# EAGLE design GBC USB-C Charging Kit Pro (EAGLE 6.2)
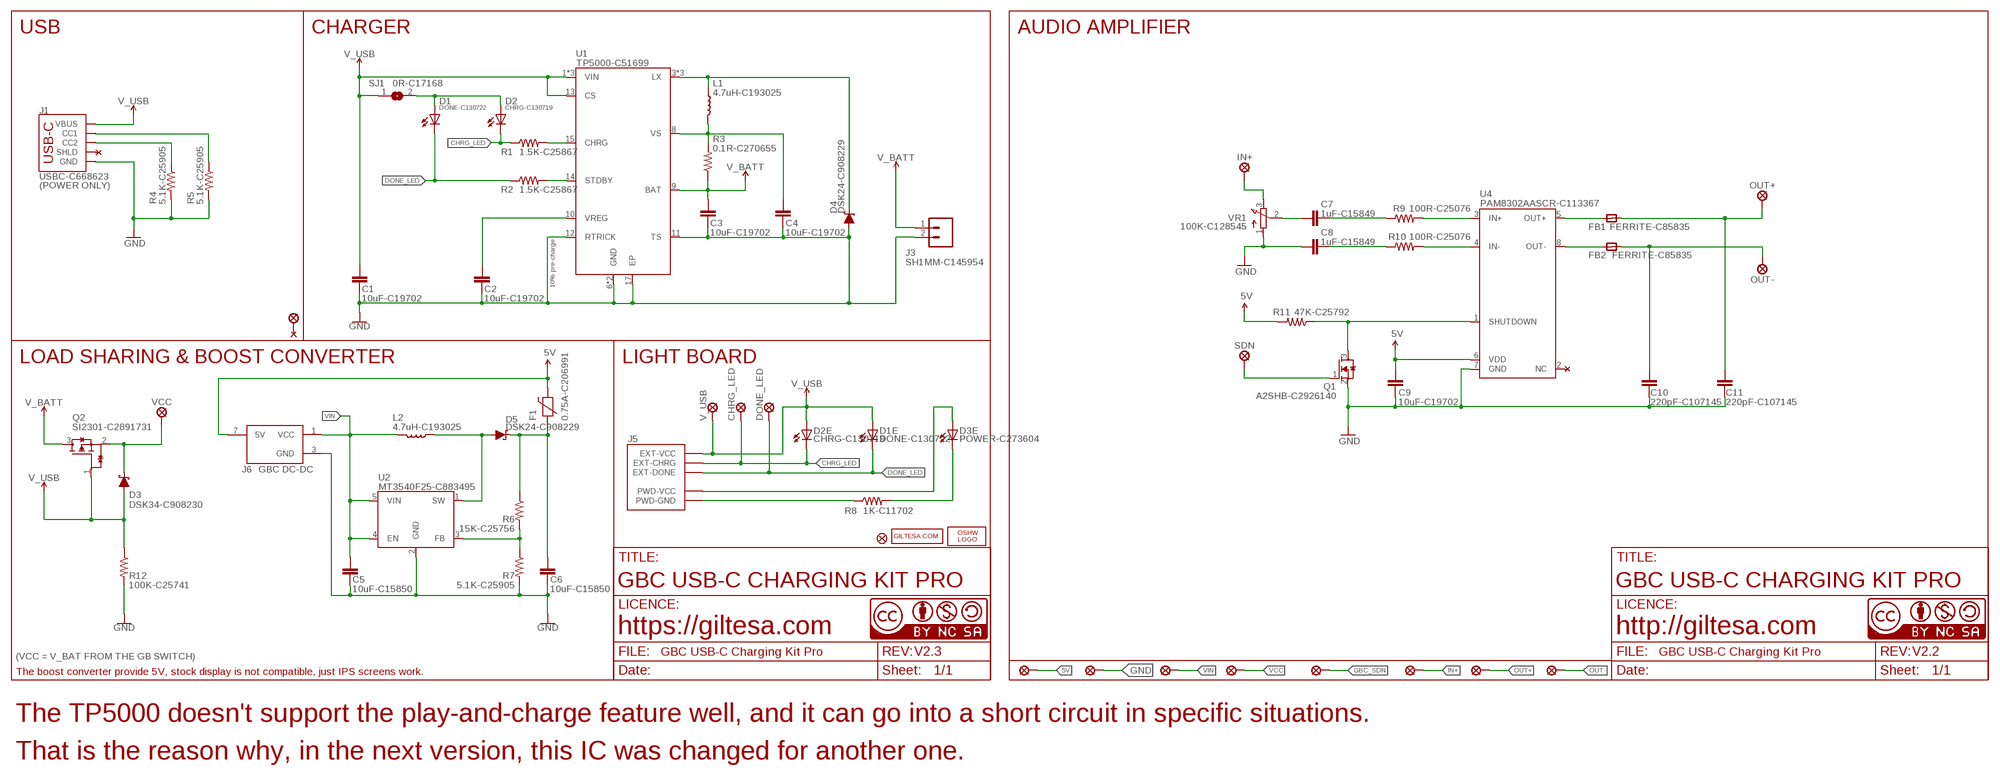
[diagram p0: schematic, sheet 1]

## Parts
C1  10uF-C19702  C0603_SMALL  [C0603_S]
C2  10uF-C19702  C0603_SMALL  [C0603_S]
C3  10uF-C19702  C0603_SMALL  [C0603_S]
C4  10uF-C19702  C0603_SMALL  [C0603_S]
C5  10uF-C15850  C0805_SMALL  [C0805_S]
C6  10uF-C15850  C0805_SMALL  [C0805_S]
C7  1uF-C15849  C0603_SMALL  [C0603_S]
C8  1uF-C15849  C0603_SMALL  [C0603_S]
C9  10uF-C19702  C0603_SMALL  [C0603_S]
C10  220pF-C107145  C0805_SMALL  [C0805_S]
C11  220pF-C107145  C0805_SMALL  [C0805_S]
D1  DONE-C130722  L0402  [L0402]
D1E  DONE-C130722  L0402  [L0402]
D2  CHRG-C130719  L0402  [L0402]
D2E  CHRG-C130719  L0402  [L0402]
D3  DSK34-C908230  DIODE-SCHOTTKY_SOD-123FL  [SOD-123FL]
D3E  POWER-C273604  L0402  [L0402]
D4  DSK24-C908229  DIODE-SCHOTTKY_SOD-123FL  [SOD-123FL]
D5  DSK24-C908229  DIODE-SCHOTTKY_SOD-123FL  [SOD-123FL]
F1  0.75A-C206991  FUSE0603_S  [F0603_S]
FB1  FERRITE-C85835  MICROBUILDER_FERRITE_SMALL  [MICROBUILDER__0805MP_S]
FB2  FERRITE-C85835  MICROBUILDER_FERRITE_SMALL  [MICROBUILDER__0805MP_S]
FD1  FIDUCIALUFIDUCIAL  [FIDUCIAL-MICRO]
FD2  FIDUCIALUFIDUCIAL  [FIDUCIAL-MICRO]
FD3  FIDUCIALUFIDUCIAL  [FIDUCIAL-MICRO]
J1  USBC-C668623  USB-CPOWER  [USB-C_6P]
J3  SH1MM-C145954  JST-21MM  [JST-2-1MM-SMD_RIGHT]
J5  GBC_LED  [GBC_LED]
J6  GBC DC-DC  GBC_DC_DCDIP  [GBC_DC_DC_DIP]
L1  4.7uH-C193025  INDUCTOR_2  [PSPMAA0402]
L2  4.7uH-C193025  INDUCTOR_2  [PSPMAA0402]
LOGO2  OSHW_LOGO_FILLX0150-NT  [OSHW_FILLX150_NOTEXT]
PP1  SOLDER_PAD-1.5  [SOLDER_PAD_1.5]
PP2  SOLDER_PAD-1.5  [SOLDER_PAD_1.5]
PP3  SOLDER_PAD-1.5  [SOLDER_PAD_1.5]
PP4  SOLDER_PAD-1.5  [SOLDER_PAD_1.5]
PP5  SOLDER_PAD-1.5  [SOLDER_PAD_1.5]
PP6  SOLDER_PAD-1.5  [SOLDER_PAD_1.5]
PP7  SOLDER_PAD-1.5  [SOLDER_PAD_1.5]
PP8  SOLDER_PAD-1.5  [SOLDER_PAD_1.5]
Q1  A2SHB-C2926140  MOSFET-NCHANNEL_SMALL  [SOT23-3_S]
Q2  SI2301-C2891731  DMP1045U_SMALL  [SOT23-3_S]
R1  1.5K-C25867  R0402  [R0402]
R2  1.5K-C25867  R0402  [R0402]
R3  0.1R-C270655  R0402  [R0402]
R4  5.1K-C25905  R0402  [R0402]
R5  5.1K-C25905  R0402  [R0402]
R6  15K-C25756  R0402  [R0402]
R7  5.1K-C25905  R0402  [R0402]
R8  1K-C11702  R0402  [R0402]
R9  100R-C25076  R0402  [R0402]
R10  100R-C25076  R0402  [R0402]
R11  47K-C25792  R0402  [R0402]
R12  100K-C25741  R0402  [R0402]
SJ1  0R-C17168  JUMPER-SMD0402  [JUMPER-SMD_0402]
U1  TP5000-C51699  TP5000  [QFN-16_4X4]
U2  MT3540F25-C883495  MT3540  [SOT-23-5]
U4  PAM8302AASCR-C113367  PAM8302A_ASCR  [PAM8302AASCR]
U$2  SDN  PAD_1.0  [PAD_1.0]
U$6  CC-BY-NC-SA15MM  [CC-BY-NC-SA_15MM]
U$16  GILTESA.COM_MASK  [GILTESA.COM_MASK]
U$17  CC-NC-BCNIX  [CC-NC-B_NIX]
U$20  OUT+  SOLDER_PAD-2.0  [SOLDER_PAD_2.0]
U$21  CC-NC-BCNIX  [CC-NC-B_NIX]
U$23  OUT-  SOLDER_PAD-2.0  [SOLDER_PAD_2.0]
U$24  CHRG_LED  SOLDER_PAD-1.3  [SOLDER_PAD_1.3]
U$25  DONE_LED  SOLDER_PAD-1.3  [SOLDER_PAD_1.3]
U$26  V_USB  SOLDER_PAD-1.3  [SOLDER_PAD_1.3]
U$29  VCC  PAD_1.25  [PAD_1.25]
U$30  IN+  SOLDER_PAD-1.3  [SOLDER_PAD_1.3]
U$32  SOLDER_PAD-2.5  [SOLDER_PAD_2.5]
VR1  100K-C128545  TRIMPOT3303W/X  [TRIMPOT_BOURNS_3303W]

## Nets
5V: C9.1 F1.2 J6.7(5V) PP1.P$1 R11.2 U4.6(VDD)
CHRG_LED: D2.C D2E.C J5.EXT-CHRG R1.1 U$24.P$1
DONE_LED: D1.C D1E.C J5.EXT-DONE R2.1 U$25.P$1
GBC_SDN: PP5.P$1 Q1.1(G) U$2.P$1
GND: C1.1 C2.1 C3.1 C4.1 C5.1 C6.1 C8.2 C9.2 C10.2 C11.2 D4.A J1.GND1(GND) J1.GND2(GND) J3.2 J6.3(GND) PP2.P$1 Q1.2(S) R4.2 R5.2 R7.2 R12.2 U1.6(GND) U1.7(GND) U1.11(TS) U1.12(RTRICK) U1.17(EP) U2.2(GND) U4.7(GND) VR1.1(A)
IN+: PP6.P$1 U$30.P$1 VR1.3(E)
N$1: D1.A D2.A SJ1.2
N$2: C6.2 D5.C F1.1 R6.1
N$3: D5.A L2.P$1 U2.1(SW)
N$4: J1.B5(CC2) R4.1
N$6: R1.2 U1.15(CHRG)
N$7: R6.2 R7.1 U2.3(FB)
N$8: J5.PWD-GND R8.1
N$9: R10.2 U4.4(IN-)
N$10: D3E.A J5.PWD-VCC
N$11: D3E.C R8.2
N$12: R9.2 U4.3(IN+)
N$13: J1.A5(CC1) R5.1
N$16: C8.1 R10.1
N$17: FB2.1 U4.8(OUT-)
N$18: C2.2 U1.10(VREG)
N$19: R2.2 U1.14(STDBY)
N$20: C4.2 L1.P$2 R3.2 U1.8(VS)
N$21: D4.C L1.P$1 U1.3(LX) U1.4(LX) U1.5(LX)
N$22: FB1.1 U4.5(OUT+)
N$23: C7.1 R9.1
N$25: C7.2 VR1.2(S)
OUT+: C11.1 FB1.2 PP7.P$1 U$20.P$1
OUT-: C10.1 FB2.2 PP8.P$1 U$23.P$1
SDN: Q1.3(D) R11.1 U4.1(SHUTDOWN)
V_BATT: C3.2 J3.1 Q2.3(D) R3.1 U1.9(BAT)
V_USB: C1.2 D1E.A D2E.A D3.A J1.VBUS1(VBUS) J1.VBUS2(VBUS) J5.EXT-VCC Q2.1(G) R12.1 SJ1.1 U1.1(VIN) U1.2(VIN) U1.13(CS) U1.16(VIN) U$26.P$1
VCC: D3.C PP4.P$1 Q2.2(S) U$29.P$1
VIN: C5.2 J6.1(VCC) L2.P$2 PP3.P$1 U2.4(EN) U2.5(VIN)
Unconnected: J1.SHLD1(SHLD) J1.SHLD2(SHLD) J1.SHLD3(SHLD) J1.SHLD4(SHLD) J1.SHLD5(SHLD) J1.SHLD6(SHLD) J1.SHLD7(SHLD) J1.SHLD8(SHLD) U4.2(NC) U$32.P$1

## Notes on the sheet
- USB | CHARGER | AUDIO AMPLIFIER
- (POWER ONLY)
- 10% pre-charge
- LOAD SHARING & BOOST CONVERTER | LIGHT BOARD
- GBC USB-C CHARGING KIT PRO | GBC USB-C CHARGING KIT PRO
- https://giltesa.com | http://giltesa.com
- (VCC = V_BAT FROM THE GB SWITCH) | V2.3 | V2.2
- The boost converter provide 5V, stock display is not compatible, just IPS screens work.
- The TP5000 doesn't support the play-and-charge feature well, and it can go into a short circuit in specific situations.
- That is the reason why, in the next version, this IC was changed for another one.

## Library data of the parts
C1-C4 C7-C9 = ,giltesa:C0603
C5 C6 C10 C11 = ,giltesa:C0805
D1 D1E D2 D2E D3E = ,giltesa:L0402
D3-D5 = ,giltesa:DIODE-SCHOTTKY
F1 = ,giltesa:FUSE
FB1 FB2 = microbuilder:MICROBUILDER_FERRITE: Ferrite Bead 0603 MMZ1608B121C - 120 Ohm @ 100MHz, 600mA, 0.15 Ohm DC Resistance - Digikey: 445-2164-1-ND BK1608HW121-T - 120 Ohm, 600mA Ferrite Chip - Digikey: 587-1876-2-ND 0805 HZ0805B272R-10 - 2.7K Ohm @ 100MHz, 200mA, 0.8 Ohm DC Resistance - Digikey: 240-2504-1-ND (see also Murata BLM21BD272SN1L) MMZ2012Y152B - 1.5K Ohm @ 100MHz, 500mA, 0.4 Ohm DC Resistance - Digikey: 445-1560-1-ND - Mainly for high frequency (80-400MHz) MMZ2012R102A - 1K Ohm @ 100MHz, 500mA, 0.3 Ohm DC Resistance - Digikey: 445-1555-2-ND - More general purpose (10-200MHz)
FD1-FD3 = SparkFun-Aesthetics:FIDUCIAL: Fiducial Alignment Points Point-of-reference for pick-and-place machines and other optical instruments.
J1 = ,giltesa:USB-C
J3 = ,giltesa:JST-2
J5 = ,giltesa:GBC_LED
J6 = ,giltesa:GBC_DC_DC
L1 L2 = ,giltesa:INDUCTOR
LOGO2 = ohw-logo:OSHW_LOGO_FILL
PP1-PP8 U$20 U$23-U$26 U$30 U$32 = ,giltesa:SOLDER_PAD
Q1 = ,giltesa:MOSFET-NCHANNEL
Q2 = ,giltesa:DMP1045U
R1-R12 = ,giltesa:R0402
SJ1 = ,giltesa:JUMPER-SMD
U1 = ,giltesa:TP5000
U2 = ,giltesa:MT3540
U4 = ,giltesa:PAM8302A
U$2 U$29 = ,giltesa:PAD
U$6 = ,giltesa_logos:CC-BY-NC-SA
U$16 = ,giltesa_logos:GILTESA.COM
U$17 U$21 = cc-by-nc-sa:CC-NC-BC: All hardware is licensed under the Creative Commons Attribution-Noncommercial-Share Alike 2.5 Switzerland License. To view a copy of this license, visit http://creativecommons.org/licenses/by-nc-sa/2.5/ch/ or send a letter to Creative Commons, 171 Second Street, Suite 300, San Francisco, California, 94105, USA.
VR1 = microbuilder:TRIMPOT: 3-Pin SMT Trimpots Bourns TC33 (X-2) Series 1K - Digikey: TC33X-102ECT-ND 10K - Digikey: TC33X-2-103E 100K - Digikey: TC33X-104ECT-ND Bourns 3303 (W) Series 3mm 10K Single Turn - Digikey: 3303W-103ETR-ND 3mm 100K Single Turn - Digikey: 3303X-104ETR-ND

## Net classes
1 power: width 0.61 mm, drill 0.406 mm, clearance 0.203 mm
2 gnd: width 0.305 mm, drill 0.406 mm, clearance 0.203 mm
3 power usb: width 0.508 mm, drill 0.406 mm, clearance 0.203 mm

## Board
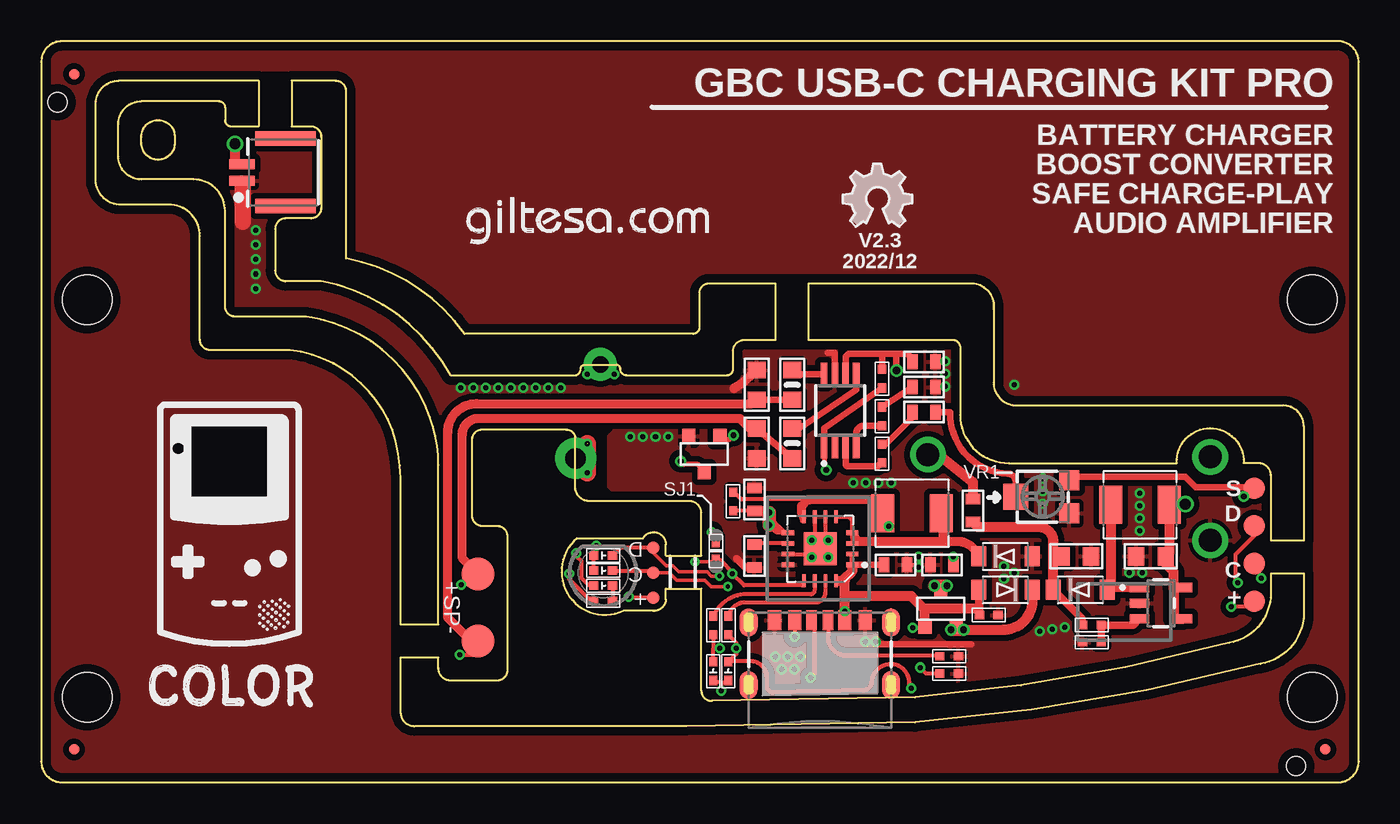
[diagram p1: board, top side]
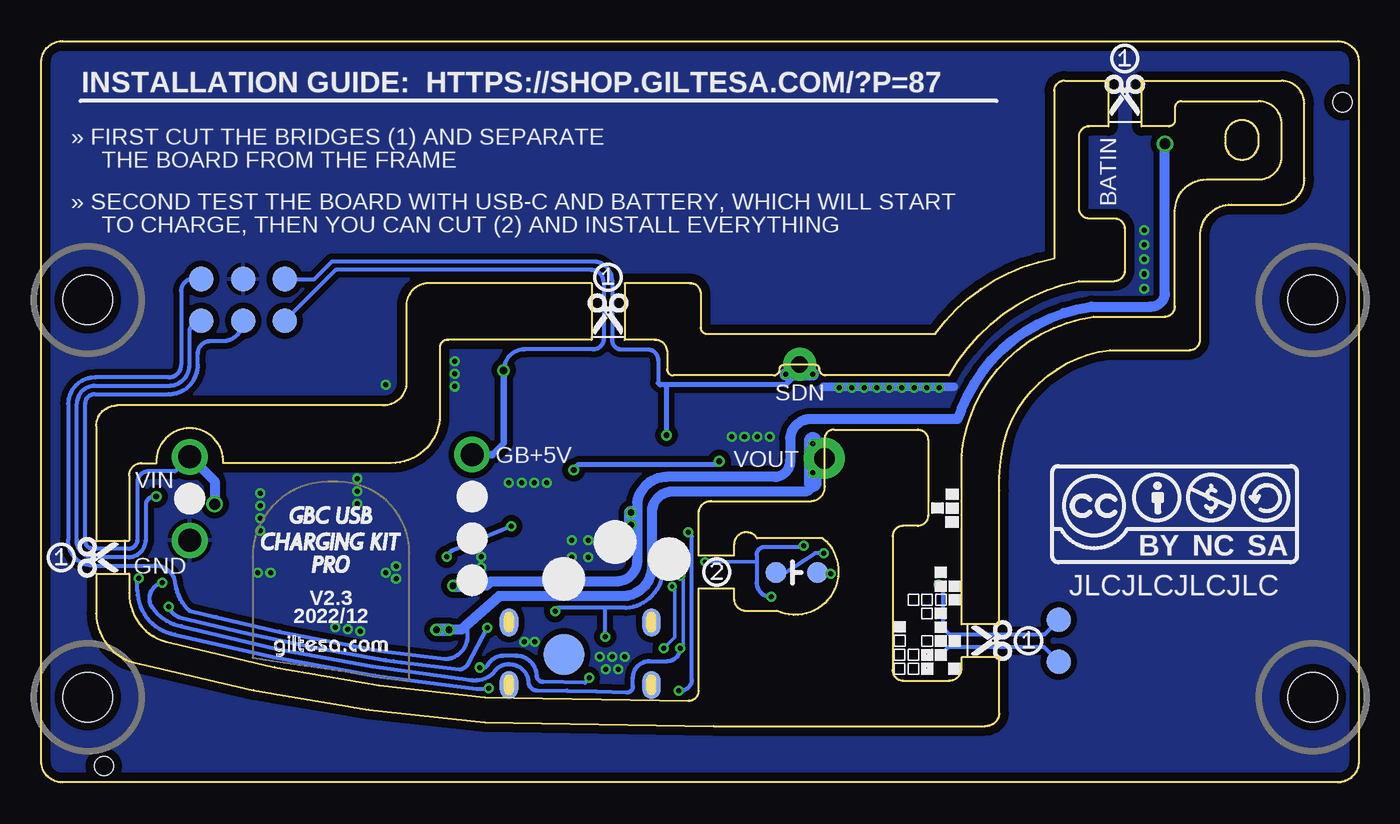
[diagram p2: board, bottom side, seen from below]

Size 80 x 45 mm. Coordinates in mm from the lower left corner, seen from the top.
Outline: 40.08,5.58 40.08,11.77 37.93,11.77 37.93,11.09 arc-90 37.13,10.42 35.33,10.42 arc-165 32.53,14.82 36.53,14.82 arc-149 37.93,14.44 37.93,13.77 40.08,13.77 40.08,16.38 arc90 39.31,17.07 33.23,17.07 arc-90 32.42,18 32.42,20.91 arc90 31.86,21.42 26.78,21.42 arc90 26.15,20.78 26.15,16.21 arc90 26.78,15.57 27.67,15.57 arc-90 28.31,14.94 28.31,6.81 arc-90 27.67,6.18 24.88,6.18 arc-90 24.11,6.94 24.11,7.59 21.83,7.59 21.83,4.2 arc90 22.69,3.42 39.19,3.42 53.06,3.63 arc10 74.03,7.19 arc80 76.66,10.24 76.66,12.67 74.66,12.67 74.66,11.51 arc-80 72.12,8.46 arc-10 53.06,5.16 40.72,4.94 arc-90 40.08,5.58
Outline: 24.88,24.7 32.37,24.7 arc90 32.75,25.1 arc-90 33.01,25.35 34.91,25.35 arc-90 35.16,25.1 arc90 35.55,24.7 41.62,24.7 arc90 42,25.08 42,26.19 arc-90 42.76,26.86 44.58,26.86 44.58,30.29 40.6,30.29 arc90 39.97,29.75 39.97,27.62 arc-90 39.58,27.23 25.71,27.23 arc44 18.5,31.81 18.5,41.98 arc90 17.87,42.6 15.21,42.6 15.21,39.83 16.37,39.83 arc-90 17,39.2 17,34.88 arc-90 16.37,34.24 14.84,34.24 arc90 14.21,33.61 14.21,31.07 arc90 14.84,30.43 17,30.43 arc-50 24.88,24.7
Outline: 46.58,26.86 55.28,26.86 arc-90 55.79,26.48 55.79,22.3 arc90 58.76,19.38 68.95,19.38 arc-185 73.01,19.38 73.9,19.38 arc-90 74.66,18.62 74.66,14.67 76.66,14.67 76.66,21.62 arc90 75.4,22.88 59.24,22.88 arc-90 57.82,24.28 57.82,28.73 arc90 56.65,30.29 46.58,30.29 46.58,26.86
Outline: 1.27,0 78.7,0 arc90 80,1.27 80,43.73 arc90 78.7,45 1.27,45 arc90 0,43.73 0,1.27 arc90 1.27,0
Outline: 23.61,22.18 arc62 16.11,28.27 11.8,28.27 arc-90 11.16,28.91 11.16,34.7 arc90 9.26,36.6 6.08,36.6 arc-90 4.68,38 4.68,39.96 arc-90 6.08,41.35 10.78,41.35 arc-90 11.16,40.97 11.16,40.21 arc90 11.54,39.83 13.21,39.83 13.21,42.6 4.71,42.6 arc90 3.31,41.2 3.31,36.68 arc90 4.71,35.08 7.73,35.08 arc-90 9.64,33.18 9.64,26.88 arc90 10.27,26.24 15.1,26.24 arc-62 21.32,21.42 arc-20 21.83,17.73 21.83,9.59 24.11,9.59 24.11,19.26 arc20 23.61,22.18
Outline: 6.08,39.2 arc-180 8.11,39.2 8.11,38.81 arc-180 6.08,38.81 6.08,39.2
Copper layers (1*16): Top 0.035mm / dielectric 1.6mm / Bottom 0.035mm
Design rules: minimum track width 6mil, minimum drill 12mil, track to track 6mil, track to pad 6mil, pad to pad 6mil, via to via 8mil, smd to smd 0mil, copper to edge 20mil, drill to drill 10mil, minimum pad ring 6mil, minimum via ring 6mil, stop-mask expansion 0mil, vias tented up to drill 100mil, thermal gap 10mil
Holes 3 mm at 77.17,29.29 2.8,29.29 2.8,5.16 77.17,5.16
tRestrict: area 9.4,17.6 to 13.4,21.4; area 8.4,20.3 to 8.4,20.3; 10 lines
bRestrict: 6 lines

### Footprints (pad centres in the part's own frame; a part is rotated, then mirrored left to right if it is on the bottom)
C0603_S = smd 0.635 x 0.9: 1 -0.694,0; 2 0.694,0
C0805_S = smd 1 x 1.1: 1 -0.901,0; 2 0.901,0
L0402 = smd 0.559 x 0.5: A -0.567,0; C 0.567,0
SOD-123FL = smd 0.91 x 1.22: A -1.637,0; C 1.637,0
F0603_S = smd 0.635 x 0.9: 1 -0.694,0; 2 0.694,0
MICROBUILDER__0805MP_S = smd 1 x 1.1: 1 -0.901,0; 2 0.901,0
FIDUCIAL-MICRO = smd 0.635 x 0.635: 1 0,0
USB-C_6P = smd 0.635 x 1.2: A5 -0.5,-0.017; B5 0.5,-0.017 | smd 0.8 x 1.2: GND1 -2.75,-0.017; GND2 2.75,-0.017; VBUS1 -1.52,-0.017; VBUS2 1.52,-0.017 | smd 1.1 x 1.7: SHLD1 -4.32,-0.15; SHLD2 4.32,-0.15; SHLD5 -4.32,-3.95; SHLD8 4.32,-3.95 | smd 1.1 x 1.7 bottom: SHLD3 -4.32,-0.15; SHLD4 4.32,-0.15; SHLD6 -4.32,-3.95; SHLD7 4.32,-3.95
JST-2-1MM-SMD_RIGHT = smd 0.6 x 1.524: 1 -0.5,-2.017; 2 0.5,-2.017 | smd 0.889 x 3.683: NC1 -2.054,0.635; NC2 2.054,0.635
GBC_LED = smd 0.762 x 0.762: EXT-CHRG -3.048,0; EXT-DONE -3.048,-1.524; EXT-VCC -3.048,1.524 | smd 1.27 x 1.27 bottom: PWD-GND 1.27,0; PWD-VCC -1.27,0
GBC_DC_DC_DIP = drill 1.397 pad 2.159: 1 17.145,7.493; 3 17.145,2.413; 7 0,7.62
PSPMAA0402 = smd 1.4 x 2.3: P$1 -1.775,0; P$2 1.775,0
SOLDER_PAD_1.5 = smd 1.5 x 1.5: P$1 0,0
SOT23-3_S = smd 0.8 x 0.9: 1 -0.95,-1.076; 2 0.95,-1.076; 3 0,1.1
R0402 = smd 0.559 x 0.5: 1 -0.567,0; 2 0.567,0
JUMPER-SMD_0402 = smd 0.635 x 0.5: 1 -0.559,0; 2 0.559,0
QFN-16_4X4 = smd 0.81 x 0.3: 1 -1.95,0.975; 2 -1.95,0.325; 3 -1.95,-0.325; 4 -1.95,-0.975; 9 1.95,-0.975; 10 1.95,-0.325; 11 1.95,0.325; 12 1.95,0.975 | smd 0.3 x 0.81: 5 -0.975,-1.95; 6 -0.325,-1.95; 7 0.325,-1.95; 8 0.975,-1.95; 13 0.975,1.95; 14 0.325,1.95; 15 -0.325,1.95; 16 -0.975,1.95 | smd 2 x 2: 17 0,0
SOT-23-5 = smd 0.55 x 1.2: 1 -0.95,-1.3; 2 0,-1.3; 3 0.95,-1.3; 4 0.95,1.3; 5 -0.95,1.3
PAM8302AASCR = smd 0.4 x 1.4: 1 -0.975,-2.2; 2 -0.325,-2.2; 3 0.325,-2.2; 4 0.975,-2.2; 5 0.975,2.2; 6 0.325,2.2; 7 -0.325,2.2; 8 -0.975,2.2
PAD_1.0 = drill 1 pad 2: P$1 0,0
JLCPCB_TOOLING_HOLES = hole 1.153: 0,0
SOLDER_PAD_2.0 = smd 2 x 2: P$1 0,0
SOLDER_PAD_1.3 = smd 1.3 x 1.3: P$1 0,0
PAD_1.25 = drill 1.25 pad 2.5: P$1 0,0
SOLDER_PAD_2.5 = smd 2.5 x 2.5: P$1 0,0
TRIMPOT_BOURNS_3303W = smd 1.2 x 1.2: 1 -1,-1.6; 3 1,-1.6 | smd 1.6 x 1.5: 2 0,1.65

### Placement (x,y rotation side)
C1  51.86,13.21 180 top
C2  43.31,13.74 90 top
C3  43.31,17.18 270 top
C4  54.69,13.21 0 top
C5  67.38,13.72 0 top
C6  62.84,13.72 180 top
C7  53.59,22.48 0 top
C8  53.59,24 0 top
C9  53.59,25.53 0 top
C10  43.43,24.13 90 top
C11  43.43,20.57 270 top
D1  40.81,6.75 90 top
D1E  34.12,13.77 0 top
D2  41.72,6.75 90 top
D2E  34.12,12.86 0 top
D3  58.55,11.68 0 top
D3E  34.12,11.95 0 top
D4  58.55,13.72 180 top
D5  63.1,11.68 180 top
F1  56.58,16.51 90 top
FB1  45.59,20.57 270 top
FB2  45.59,24.13 270 top
FD1  2,43 0 top
FD2  2,2 0 top
FD3  77.97,2 0 top
J1  47.28,9.87 0 top
J3  14.21,37.04 270 top
J5  34.12,12.73 180 top
J6  53.83,12.27 0 top
L1  52.88,16.34 180 top
L2  66.71,16.85 0 top
LOGO2  48.65,33.75 0 top
PP1  65.2,28.02 0 bottom
PP2  67.75,30.56 0 bottom
PP3  67.75,28.02 0 bottom
PP4  70.28,30.56 0 bottom
PP5  65.2,30.56 0 bottom
PP6  70.28,28.02 0 bottom
PP7  18.21,9.86 0 bottom
PP8  18.21,7.32 0 bottom
Q1  40.26,19.94 180 top
Q2  54.61,10.54 0 top
R1  41.72,9.53 90 top
R2  40.81,9.53 90 top
R3  42.01,17.05 90 top
R4  55.13,7.65 0 top
R5  55.13,6.61 0 top
R6  63.79,9.55 0 top
R7  63.79,8.51 180 top
R8  34.12,11.03 0 top
R9  51.05,19.96 270 top
R10  51.05,22.23 270 top
R11  51.05,24.51 90 top
R12  57.53,10.16 0 top
SJ1  40.96,14.05 90 top
U1  47.29,14.18 180 top
U2  67.98,10.88 270 top
U4  48.51,22.59 0 top
U$2  33.94,25.38 0 top
U$6  18.74,13.24 0 bottom
U$7  [GAME_BOY_COLOR_1.2]  6.52,4.55 0 top
U$8  [SCISSOR]  45.57,27.19 90 bottom
U$10  [TETRIS]  24.05,6.43 0 top
U$12  [JLCPCB_TOOLING_HOLES]  1,41.29 0 top
U$13  [SCISSOR]  14.2,40.46 90 bottom
U$14  [SCISSOR]  23.55,8.6 0 bottom
U$15  [SCISSOR]  75.29,13.67 180 bottom
U$16  25.7,32.59 0 top
U$17  0,0 0 top
U$18  [JLCPCB_TOOLING_HOLES]  76.19,1 0 top
U$20  26.53,12.65 0 top
U$21  0,0 0 top
U$23  26.53,8.59 0 top
U$24  73.64,13.29 0 top
U$25  73.64,15.57 0 top
U$26  73.64,11 0 top
U$28  [GAME_BOY_COLOR_2]  7.02,8.21 0 top
U$29  32.45,19.67 0 top
U$30  73.64,17.86 0 top
U$32  48.27,7.78 0 bottom
U$33  [GILTESA.COM_MASK_7MM]  65.9,7.57 0 bottom
U$34  [GAME_BOY_COLOR_USB_CHARGING_KIT_PRO]  66.66,12.65 0 bottom
U$36  [SCISSOR_ONE]  20.05,8.6 0 bottom
U$37  [SCISSOR_ONE]  78.78,13.65 0 bottom
U$38  [SCISSOR_ONE]  45.58,30.67 0 bottom
U$39  [SCISSOR_ONE]  14.21,43.95 0 bottom
U$40  [SCISSOR_TWO]  38.99,12.78 0 bottom
VR1  60.82,17.34 90 top

### Tracks (layer width: path | path; a pad name or v marks a point on that pad's centre or on a via)
5V  (via drill 0.46)
  Top 0.406: U4.6 48.84,25.73 arc-90 49.15,26.04 51.18,26.04 | 51.18,26.04 51.92,26.04 | 51.92,26.04 52.39,26.04 arc-90 C9.1 | 51.18,26.04 51.05,25.91 R11.2 | v51.92,25.02 51.92,26.04
  Top 0.61: J6.7 54.48,19.89 56.58,18.22 F1.2
  Bottom 0.254: 65.01,28.08 65.01,28.02 PP1.P$1 62.11,31.11 46.61,31.11 arc90 45.85,30.35 45.85,26.92 arc90 46.48,26.29 50.65,26.29 arc-90 v51.92,25.02
  Bottom 0.406: 52.6,19.89 51.92,20.57 v51.92,25.02
  Bottom 0.457: 52.6,19.89 J6.7
CHRG_LED  (via drill 0.25, 0.3)
  Top 0.203: 37.24,12.73 J5.EXT-CHRG 38.13,12.73 38.59,12.28 40.3,12.28 40.69,11.89 v41.69,11.89
  Top 0.254: D2E.C 37.04,12.86 J5.EXT-CHRG | U$24.P$1 v74.09,12.4 | v52.83,5.71 52.7,5.71 52.7,6.1 arc90 51.56,7.18 arc85 50.42,6.1 arc-90 49.91,5.59 44.45,5.46 arc-93 44.07,5.84 44.07,6.35 arc90 43.05,7.37 41.77,7.37 arc90 D2.C 42.21,7.81 v42.21,8.13 42.21,8.47 R1.1
  Bottom 0.203: v42.21,8.13 41.53,8.81 41.53,11.73 v41.69,11.89
  Bottom 0.254: v74.09,12.4 74.15,12.34 74.15,11.64 arc-80 71.87,8.97 arc-8 53.58,5.67 52.88,5.67 v52.83,5.71
DONE_LED  (via drill 0.25, 0.3)
  Top 0.203: J5.EXT-DONE 37.17,13.95 37.96,13.16 38.34,13.16 38.72,12.78 40.44,12.78 40.69,12.53 v41.18,12.53
  Top 0.254: J5.EXT-DONE 35.18,14.26 D1E.C | U$25.P$1 73.64,15.45 | U$25.P$1 73.64,15.7 | R2.1 40.81,8.13 | 40.81,8.13 v41.21,8.13 | D1.C 40.81,8.13 | v72.64,12.13 72.52,12.32 72.52,13.84 73.66,14.99 73.66,15.56 U$25.P$1
  Bottom 0.203: v41.21,8.13 41.14,8.13 41.02,8.26 41.02,12.36 v41.18,12.53
  Bottom 0.254: v41.21,8.13 arc90 41.98,7.37 43.05,7.37 arc-90 44.07,6.35 44.07,5.84 arc95 44.45,5.46 arc-3 49.91,5.59 arc90 50.42,6.1 arc-85 51.56,7.18 51.69,7.18 arc-58 52.53,6.64 arc53 54.01,6.23 arc8 71.49,9.48 arc45 73.26,10.62 arc109 v72.64,12.13
GBC_SDN  (via drill 0.3, 0.36)
  Top 0.305: Q1.1 41.23,20.83 41.78,20.83 v42.04,21.08
  Bottom 0.254: PP5.P$1 63.42,30.56 62.36,31.62 46.48,31.62 arc90 45.34,30.48 45.34,26.92 arc-90 44.83,26.29 43.18,26.29 arc90 42.55,25.65 42.55,24.26 | v34.8,24.77 34.16,24.77 34.1,24.83
  Bottom 0.305: U$2.P$1 33.95,24.98 34.1,24.83 34.8,24.13 42.04,24.13 | 42.04,24.13 42.42,24.13 42.55,24.26 | 42.04,24.13 v42.04,21.08
  Bottom 0.762: v33.15,24.77 v34.8,24.77
GND  (via drill 0.3)
  Top 0.254: U1.11 46.84,13.86 | U1.6 47.62,14.73 | 47.62,14.73 47.49,14.61 | v47.8,14.69 47.53,14.69 47.62,14.73 | U1.7 46.97,14.51 U1.17 | C1.1 53.27,13.21 v53.27,13.68
  Top 0.406: 46.84,13.86 47.49,13.86 47.49,14.51 | 47.49,14.51 47.49,14.61 | 47.49,14.51 47.16,14.51 | 46.97,14.51 47.16,14.51 | 47.16,14.51 U1.17 | U4.7 48.19,26.08 48.01,26.08 47.75,26.08 | 56.46,8.39 50.8,8.39 v50.66,8.54
  Top 0.457: C2.1 42.77,13.04 42.23,13.59
  Top 0.559: 43.32,25.03 arc-30 42.06,23.93
  Top 0.711: C10.2 43.32,25.03
  Top 1.016: 12.25,34.04 12.25,36.22
  Bottom 0.508: 24.59,24.03 32.51,24.03
  other vias: 25.46,23.96 26.22,23.96 26.99,23.96 27.75,23.96 28.51,23.96 29.27,23.96 30.03,23.96 30.8,23.96 31.56,23.96 13.02,33.53 13.02,32.64 13.02,31.75 13.02,30.86 13.02,29.98 44.57,7.62 45.34,7.62 46.1,7.62 44.96,6.86 45.72,6.86 46.78,14.69 46.78,13.67 54.9,25.56 54.9,24.8 54.9,24.04 59.09,24.15 49.31,18.19 50.07,18.19 50.84,18.19 51.6,18.19 35.77,20.99 36.54,20.99 47.8,13.67 50.02,8.54 53.27,13.05 60.62,9.18 61.38,9.3 62.14,9.43 66.71,17.56 66.71,16.8 66.71,16.03 66.71,15.27 60.82,18.45 60.82,17.68 60.82,16.92 66.08,12.73 66.84,12.73 58.46,13.11 58.46,12.35 59.09,12.73 37.3,20.99 38.06,20.99
  pour Top (isolate 0.356): -2,47 81.97,47 81.97,-2 -2,-2
  pour Bottom (isolate 0.356): -2,47 81.97,47 81.97,-2 -2,-2
IN+  (via drill 0.36)
  Top 0.254: v73.01,17.35 73.52,17.86 U$30.P$1
  Top 0.406: U$30.P$1 73.6,17.91 70.1,17.91 69.47,18.54 62.62,18.54 arc90 VR1.3
  Bottom 0.254: v73.01,17.35 73.14,17.35 arc-90 73.64,16.84 73.64,14.74 arc90 74.71,13.67 76.85,13.67 arc94 77.84,14.74 77.84,22.99 arc90 76.75,24.07 72.26,24.07 arc-90 70.99,25.34 70.99,27.31 arc90 PP6.P$1
  Bottom 0.406: 72.96,17.4 v73.01,17.35
N$1  (via drill 0.3)
  Top 0.254: 41.28,6.07 v41.28,5.55 | SJ1.2 v40.71,15.19 | 41.28,6.07 40.92,6.07 arc-90 D1.A | 41.28,6.07 41.61,6.07 arc90 D2.A
  Bottom 0.254: v40.71,15.19 40.5,14.91 40.5,6.2 arc90 v41.28,5.55
N$2
  Top 0.457: R6.1 63.22,9.92 D5.C
  Top 0.61: D5.C 61.46,13.72 | 61.46,13.72 61.46,14.61 arc90 60.58,15.49 56.84,15.49 F1.1 | C6.2 61.46,13.72
N$3
  Top 0.61: L2.P$1 64.94,11.88 D5.A 64.88,11.83 U2.1
N$4
  Top 0.254: J1.B5 47.78,8.87 arc90 48.9,7.68 54.52,7.68 R4.1
N$6
  Top 0.254: U1.15 47.62,11.55 arc-90 46.99,10.92 42.68,10.92 arc75 R1.2
N$7
  Top 0.457: R7.1 R6.2 66.3,9.55 U2.3
N$8  (via drill 0.3)
  Top 0.254: R8.1 33.31,11.08 32.05,12.34 v32.05,12.65
  Bottom 0.254: J5.PWD-GND 32.07,12.73 v32.05,12.65
N$9
  Top 0.406: R10.2 49.98,21.66 arc90 49.49,21.17 U4.4
N$10  (via drill 0.3)
  Top 0.254: D3E.A 33.24,11.97 32.81,12.4 32.81,13.41 32.5,13.73 v32.5,13.92
  Bottom 0.254: v32.5,13.92 33.01,13.92 34.83,12.73 J5.PWD-VCC
N$11
  Top 0.254: D3E.C R8.2
N$12
  Top 0.406: R9.2 51.02,19.4 50.8,19.18 49.02,19.18 arc-90 48.84,19.36 U4.3
N$13  (via drill 0.3)
  Top 0.254: 46.86,9.53 46.78,9.61 J1.A5 46.97,9.63 46.97,6.58 v46.74,6.35 | R5.1 53.73,6.61 v53.37,6.97
  Bottom 0.254: v46.74,6.35 46.99,6.04 49.53,6.1 arc90 49.91,6.48 arc-90 51.18,7.68 51.97,7.68 arc-59 52.88,7.14 53.05,6.97 v53.37,6.97
N$16
  Top 0.406: R10.1 C8.1
N$17
  Top 0.406: U4.8 45.84,24.79 FB2.1
N$18
  Top 0.254: C2.2 43.35,14.43 43.53,14.51 U1.10
N$19
  Top 0.254: U1.14 46.97,11.66 arc-90 46.74,11.43 42.65,11.43 arc60 R2.2
N$20  (via drill 0.3)
  Top 0.254: R3.2 42.07,17.62 42.51,17.18 46.58,17.18 arc-90 46.61,17.14 | 46.3,15.98 U1.8 46.2,15.86 46.02,16.36 46.18,16.38 | v51.45,15.54 51.17,16.34 L1.P$2 | C4.2 55.26,13.56 v55.39,13.69
  Top 0.559: 50.8,17.14 46.61,17.14 46.48,17.14 46.18,16.76 46.18,16.38
  Top 0.61: L1.P$2 51.1,16.84 50.8,17.14
  Bottom 0.254: v51.45,15.54 54.99,14.1 arc-44 v55.39,13.69
N$21
  Top 0.254: U1.4 49.24,15.78 arc90 48.89,16.13 U1.5 | U1.4 U1.3 | 49.4,14.86 49.24,14.86 U1.4
  Top 0.559: 54.74,14.64 49.59,14.64 49.4,14.86 | L1.P$1 54.48,16.17 54.48,15.62 54.74,15.62 54.74,14.64 | 54.74,14.64 55.61,14.64 arc-70 D4.C
N$22
  Top 0.406: U4.5 49.49,23.84 46.35,21.72 45.99,21.48 FB1.1
N$23
  Top 0.406: R9.1 51.27,20.53 52.91,22.18 C7.1
N$25
  Top 0.406: C7.2 55.19,22.48 arc90 58.67,18.75 arc-90 59.17,18.25 VR1.2
OUT+  (via drill 0.3)
  Top 0.254: v25.51,11.99 26.18,12.65 U$20.P$1
  Top 0.406: FB1.2 C11.1
  Top 0.559: U$20.P$1 25.58,13.61 25.58,21.13 arc-90 26.54,22.1 42.42,22.1 43.05,21.46 C11.1
  Top 0.61: U$20.P$1 26.34,12.65
  Bottom 0.254: PP7.P$1 19.11,8.97 24.84,8.97 25.27,9.4 25.27,11.75 v25.51,11.99
OUT-  (via drill 0.3)
  Top 0.254: v25.4,7.75 26.54,7.75 26.54,8.58 U$23.P$1
  Top 0.406: FB2.2 C10.1
  Top 0.559: 26.08,8.59 24.69,9.98 24.69,21.26 arc-90 26.42,22.99 43.18,22.99 C10.1
  Top 0.61: U$23.P$1 26.08,8.59
  Bottom 0.254: PP8.P$1 19.1,8.21 24.94,8.21 v25.4,7.75
SDN  (via drill 0.36)
  Top 0.305: Q1.3 40.26,18.92 39.88,19.3 39.02,19.3 v38.83,19.5 | U4.1 47.54,19.09 v47.67,18.96
  Top 0.406: U4.1 47.54,21.5 50.04,23.24 R11.1 | Q1.3 40.26,18.8
  Bottom 0.305: v47.67,18.96 47.67,19.01 47.37,19.3 39.02,19.3 v38.83,19.5
V_BATT  (via drill 0.41, 0.66)
  Top 0.254: U1.9 44.66,15.16 44.58,15.24 44.7,15.37 | 44.7,15.37 44.83,15.49 45.09,15.24 44.83,15.24 44.7,15.37 | C3.2 R3.1
  Top 0.61: J3.1 11.73,37.54 11.77,37.6 v11.77,38.76 | C3.2 44.09,16.48 v44.2,16.38 44.2,15.88 44.7,15.37
  Top 0.711: 54.57,11.94 Q2.3
  Top 0.762: v54.99,11.94 54.57,11.94 v54.23,11.94
  Top 0.813: v44.2,15.62 v44.2,16.38
  Bottom 0.61: v11.77,38.76 11.77,29.67 arc90 12.69,28.88 16.24,28.88 arc-60 24.11,22.69 24.37,22.05 33.39,22.05 arc-80 34.53,20.91 34.53,19.57 arc90 35.43,18.54 42.04,18.54 arc-80 43.81,17.02 43.81,16.26 | 43.81,16.26 43.81,13.46 arc90 45.09,12.19 52.7,12.19 52.96,11.94 v54.23,11.94 | 43.81,16.26 44.07,16.26 v44.2,16.38
  Bottom 0.762: v54.23,11.94 v54.99,11.94
  Bottom 0.813: v44.2,16.38 v44.2,15.62
V_USB  (via drill 0.25, 0.3)
  Top 0.203: SJ1.1 40.89,13.49 40.89,13.34 | v39.7,13.39 40.96,13.39
  Top 0.254: J5.EXT-VCC 35.72,11.21 v35.67,11.26 | D2E.A D1E.A 33.56,14.22 v33.7,14.37 | U1.16 48.43,12.23 | U1.1 49.24,13.06 | 40.86,13.46 SJ1.1 | U$26.P$1 73.61,11 73.28,10.67 v72.26,10.67 | 40.96,13.39 SJ1.1 | SJ1.1 41.25,13.49 41.97,12.77 v41.97,12.68 42.69,11.96 46.2,11.96 46.32,12.15 U1.13 | J1.VBUS1 v45.76,8.85 | v52.92,9.4 53.6,9.4 arc-90 Q2.1
  Top 0.305: U1.1 U1.2
  Top 0.406: U1.1 C1.2 arc90 C1.2
  Top 0.457: 56.84,10.54 56.96,10.54 56.96,10.79
  Top 0.508: R12.1 56.96,10.79 56.96,11.68 D3.A
  Top 0.61: 48.43,12.23 48.68,12.23 | 48.68,12.23 48.77,12.32 | 48.77,12.32 49.24,12.79 49.24,13.06 | 48.8,12.24 48.68,12.23 | J1.VBUS2 v48.8,10.38 48.8,11.05 | 48.8,11.05 48.8,12.24 | 48.8,12.24 48.8,12.29 arc90 48.77,12.32 | 48.8,11.05 48.92,11.3 52.83,11.3 53.59,10.54 | 56.96,11.63 D3.A | 56.84,10.54 53.59,10.54 | Q2.1 53.66,10.47 53.59,10.54
  Bottom 0.203: v39.7,13.39 36.56,13.39 36.56,13.34
  Bottom 0.254: v72.26,10.67 arc-50 71.63,10.03 arc-5 59.56,7.49 arc0 58.12,7.29 54.61,6.86 arc-50 54.1,7.14 v52.92,9.4 | v33.7,14.37 33.77,14.3 36.05,14.3 arc-90 36.56,13.8 36.56,13.34 36.56,12.14 arc-90 v35.67,11.26 | v41.97,12.68 42.19,12.68 42.27,12.57 arc75 44.5,10.59 45.72,10.59 | 45.72,10.59 48.56,10.59 arc-90 v48.8,10.38 | v45.76,8.85 45.76,10.58 45.72,10.59
VCC  (via drill 0.3, 0.41)  (1 unrouted)
  Top 0.61: v56.01,9.27 58.42,9.27 arc90 60.2,11.05 60.2,11.67 arc90 D3.C
  Top 0.762: v56.01,9.27 v55.24,9.27 55.56,9.34 Q2.2
  Top 1.067: v33.15,20.56 v33.15,18.78
  Bottom 0.254: PP4.P$1 70.79,30.56 arc-90 71.5,29.84 71.5,25.34 arc90 72.26,24.58 76.71,24.58 arc-90 78.36,22.99 78.36,14.74 arc-92 76.85,13.16 73.11,13.16 arc80 71.88,12.19 arc-45 70.99,10.41 69.34,10.03 65.53,9.14 59.44,8 55.5,7.49 arc-90 54.1,8.89 54.1,9.4 arc-90 54.48,9.27
  Bottom 0.406: 33.15,20.75 33.15,20.57
  Bottom 0.61: 33.15,18.16 arc90 33.78,17.65 41.66,17.65 arc-90 42.93,16.38 42.93,12.95 arc80 44.58,11.3 52.2,11.3 54.48,9.27 v55.24,9.27 | U$29.P$1 32.45,19.68 33.15,19.68
  Bottom 0.762: v55.24,9.27 v56.01,9.27
  Bottom 1.067: 33.15,20.75 33.15,19.68 33.15,18.16
VIN  (via drill 0.66)
  Top 0.508: U2.5 68.76,11.83
  Top 0.61: v69.47,16.89 69.43,16.85 L2.P$2 68.48,13.84 arc90 68.28,13.63 C5.2 68.33,13.67 68.33,13.21 68.76,12.77 68.76,11.83 arc90 68.76,11.81 68.76,9.93 U2.4
  Bottom 0.254: 68.31,28.02 PP3.P$1 arc90 68.97,26.8 69.72,26.8 arc-90 70.48,26.04 70.48,25.34 arc90 72.26,23.57 76.75,23.57 arc-90 77.33,22.99 77.33,14.74 arc-99 76.85,14.18 74.71,14.18 arc-90 74.15,14.74 74.15,18.24 arc90 73.52,18.88 71.87,18.88 J6.1
  Bottom 0.61: J6.1 70.95,19.77 69.47,18.29 v69.47,16.89

### Text on the board
tPlace: GBC USB-C CHARGING KIT PRO | BATTERY CHARGER | BOOST CONVERTER | SAFE CHARGE-PLAY | AUDIO AMPLIFIER | V2.3 | 2022/12 | VR1 | SJ1 | S | D | D | C | C | +SP- | + | +
bPlace: INSTALLATION GUIDE: HTTPS://SHOP.GILTESA.COM/?P=87 | » FIRST CUT THE BRIDGES (1) AND SEPARATE | THE BOARD FROM THE FRAME | BATIN | » SECOND TEST THE BOARD WITH USB-C AND BATTERY, WHICH WILL START | TO CHARGE, THEN YOU CAN CUT (2) AND INSTALL EVERYTHING | SDN | VOUT | GB+5V | VIN | GND | JLCJLCJLCJLC | V2.3 | 2022/12
Measures: 0.0562248995983936